# Altium schematic sheet RS485_CCU_HAS.SchDoc: CCU- RS485
size B; DrawnBy: M. Seago; Organization: Gravitas; Address1: Sponsored By:; Address2: Alan Morgan; Address3: Technical Advisor:; Address4: Dr. Joseph Morgan; Revision: 1A; SheetNumber: 6; SheetTotal: 9
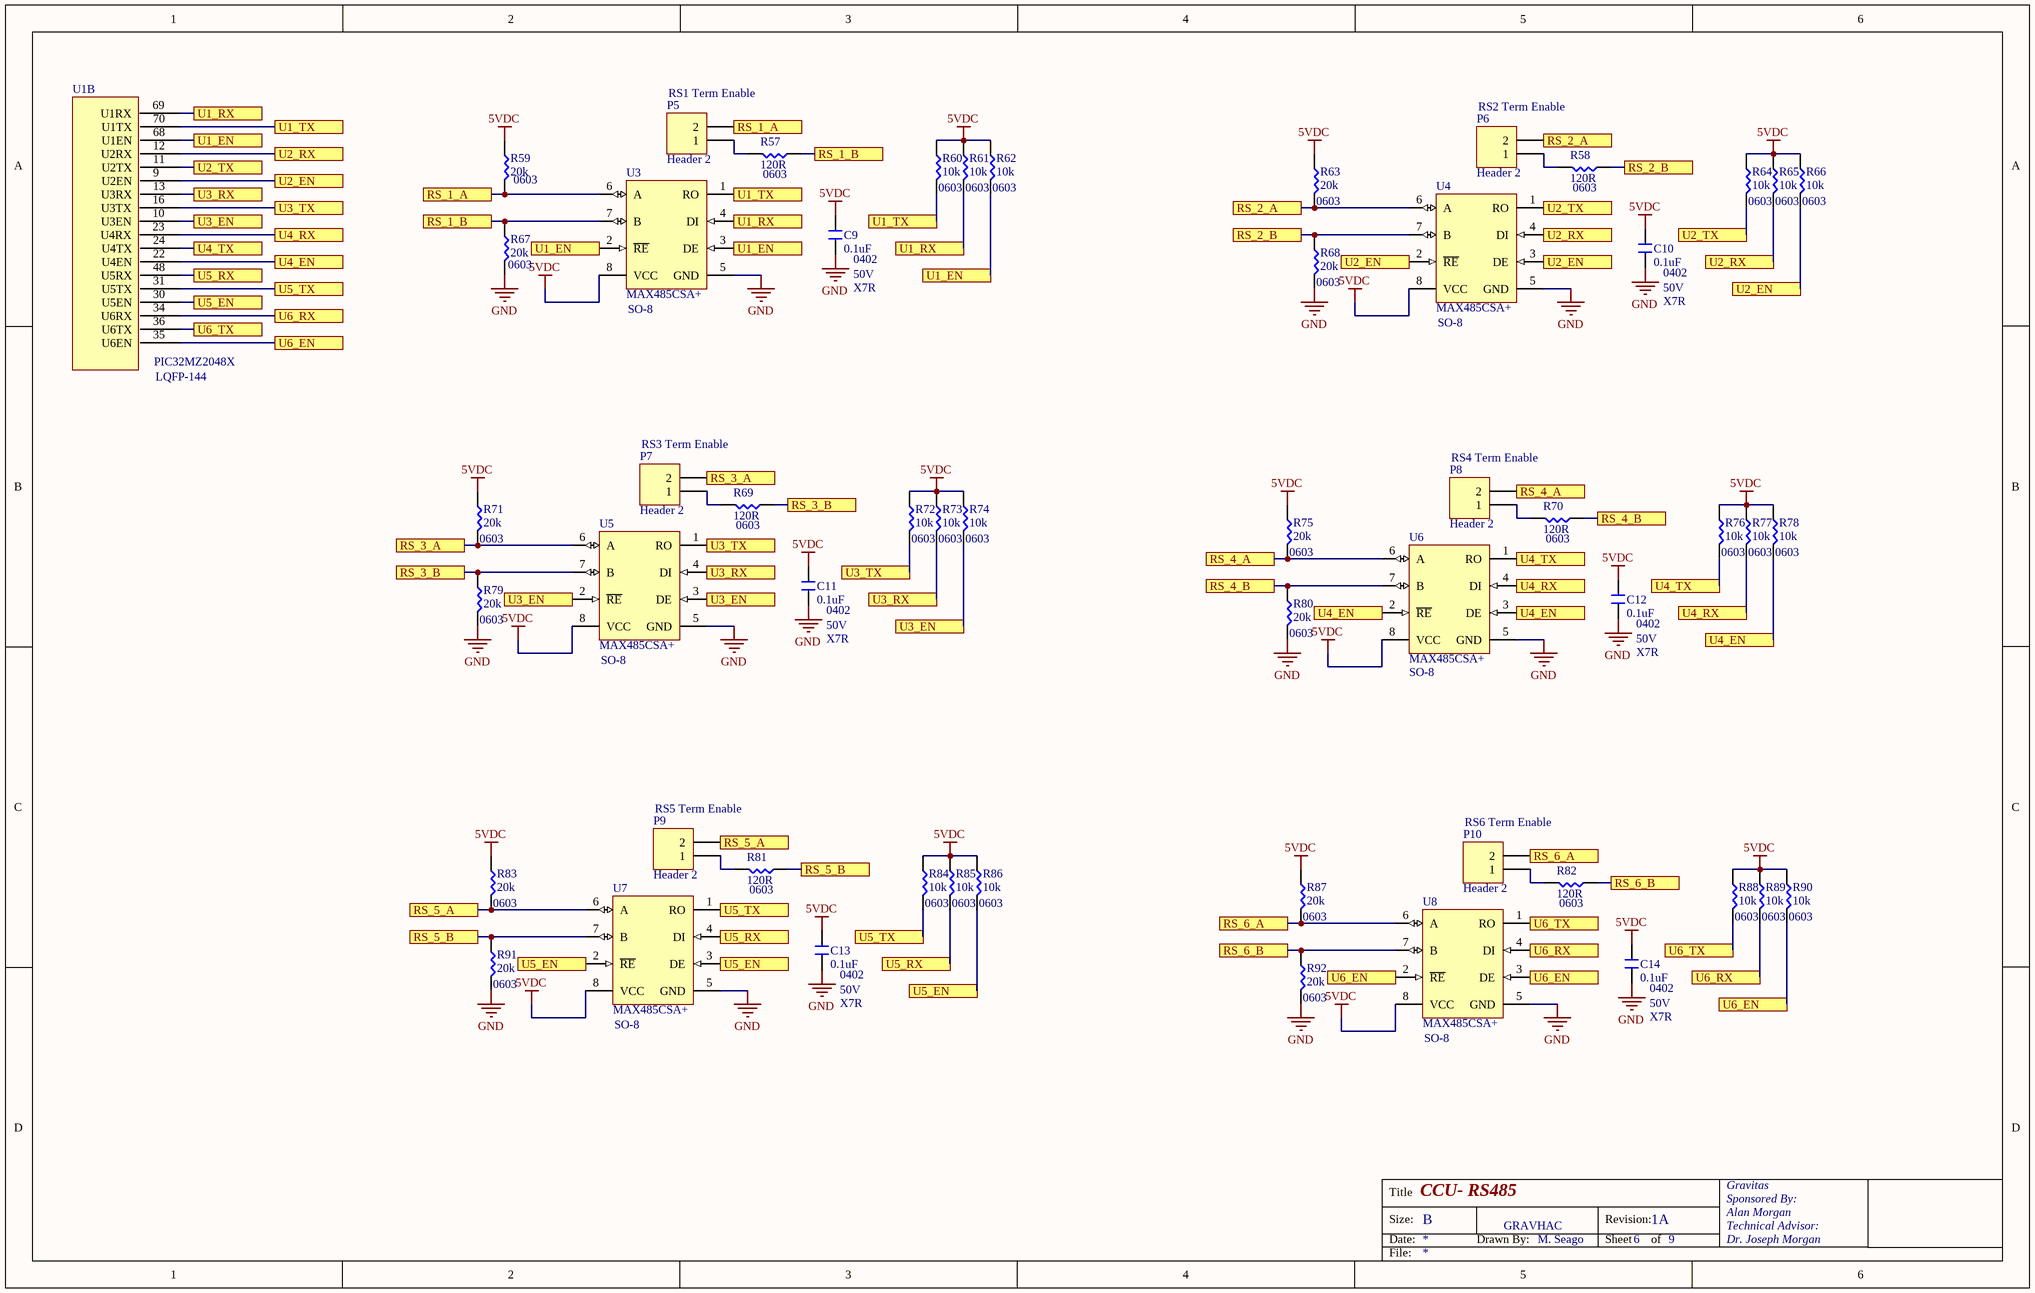
[diagram p0: RS485_CCU_HAS.SchDoc]

## Parts
C9  0.1uF  [NonPolar-0402]
C10  0.1uF  [NonPolar-0402]
C11  0.1uF  [NonPolar-0402]
C12  0.1uF  [NonPolar-0402]
C13  0.1uF  [NonPolar-0402]
C14  0.1uF  [NonPolar-0402]
P5  Header 2  [HDR1X2]
P6  Header 2  [HDR1X2]
P7  Header 2  [HDR1X2]
P8  Header 2  [HDR1X2]
P9  Header 2  [HDR1X2]
P10  Header 2  [HDR1X2]
R57  120R  [NonPolar-0603]
R58  120R  [NonPolar-0603]
R59  20k  [NonPolar-0603]
R60  10k  [NonPolar-0603]
R61  10k  [NonPolar-0603]
R62  10k  [NonPolar-0603]
R63  20k  [NonPolar-0603]
R64  10k  [NonPolar-0603]
R65  10k  [NonPolar-0603]
R66  10k  [NonPolar-0603]
R67  20k  [NonPolar-0603]
R68  20k  [NonPolar-0603]
R69  120R  [NonPolar-0603]
R70  120R  [NonPolar-0603]
R71  20k  [NonPolar-0603]
R72  10k  [NonPolar-0603]
R73  10k  [NonPolar-0603]
R74  10k  [NonPolar-0603]
R75  20k  [NonPolar-0603]
R76  10k  [NonPolar-0603]
R77  10k  [NonPolar-0603]
R78  10k  [NonPolar-0603]
R79  20k  [NonPolar-0603]
R80  20k  [NonPolar-0603]
R81  120R  [NonPolar-0603]
R82  120R  [NonPolar-0603]
R83  20k  [NonPolar-0603]
R84  10k  [NonPolar-0603]
R85  10k  [NonPolar-0603]
R86  10k  [NonPolar-0603]
R87  20k  [NonPolar-0603]
R88  10k  [NonPolar-0603]
R89  10k  [NonPolar-0603]
R90  10k  [NonPolar-0603]
R91  20k  [NonPolar-0603]
R92  20k  [NonPolar-0603]
U1  PIC32MZ2048X  [BIG_PIC32MZ]  (part B of 7)
U3  MAX485CSA+  [MAXM-MAX485CSA+-8_M]
U4  MAX485CSA+  [MAXM-MAX485CSA+-8_M]
U5  MAX485CSA+  [MAXM-MAX485CSA+-8_M]
U6  MAX485CSA+  [MAXM-MAX485CSA+-8_M]
U7  MAX485CSA+  [MAXM-MAX485CSA+-8_M]
U8  MAX485CSA+  [MAXM-MAX485CSA+-8_M]

## Ports
RS_1_A, RS_1_B, RS_2_A, RS_2_B, RS_3_A, RS_3_B, RS_4_A, RS_4_B, RS_5_A, RS_5_B, RS_6_A, RS_6_B, U1_EN, U1_RX, U1_TX, U2_EN, U2_RX, U2_TX, U3_EN, U3_RX, U3_TX, U4_EN, U4_RX, U4_TX, U5_EN, U5_RX, U5_TX, U6_EN, U6_RX, U6_TX

## Nets
5VDC: C9.2 C10.2 C11.2 C12.2 C13.2 C14.2 R59.2 R60.2 R61.2 R62.2 R63.2 R64.2 R65.2 R66.2 R71.2 R72.2 R73.2 R74.2 R75.2 R76.2 R77.2 R78.2 R83.2 R84.2 R85.2 R86.2 R87.2 R88.2 R89.2 R90.2 U3.8(VCC) U4.8(VCC) U5.8(VCC) U6.8(VCC) U7.8(VCC) U8.8(VCC)
GND: C9.1 C10.1 C11.1 C12.1 C13.1 C14.1 R67.1 R68.1 R79.1 R80.1 R91.1 R92.1 U3.5(GND) U4.5(GND) U5.5(GND) U6.5(GND) U7.5(GND) U8.5(GND)
RS_1_A: P5.2 R59.1 U3.6(A) ; port RS_1_A
RS_1_B: R57.2 R67.2 U3.7(B) ; port RS_1_B
RS_2_A: P6.2 R63.1 U4.6(A) ; port RS_2_A
RS_2_B: R58.2 R68.2 U4.7(B) ; port RS_2_B
RS_3_A: P7.2 R71.1 U5.6(A) ; port RS_3_A
RS_3_B: R69.2 R79.2 U5.7(B) ; port RS_3_B
RS_4_A: P8.2 R75.1 U6.6(A) ; port RS_4_A
RS_4_B: R70.2 R80.2 U6.7(B) ; port RS_4_B
RS_5_A: P9.2 R83.1 U7.6(A) ; port RS_5_A
RS_5_B: R81.2 R91.2 U7.7(B) ; port RS_5_B
RS_6_A: P10.2 R87.1 U8.6(A) ; port RS_6_A
RS_6_B: R82.2 R92.2 U8.7(B) ; port RS_6_B
U1_EN: R62.1 U1.68(U1EN) U3.2(~{RE}) U3.3(DE) ; port U1_EN
U1_RX: R61.1 U1.69(U1RX) U3.4(DI) ; port U1_RX
U1_TX: R60.1 U1.70(U1TX) U3.1(RO) ; port U1_TX
U2_EN: R66.1 U1.9(U2EN) U4.2(~{RE}) U4.3(DE) ; port U2_EN
U2_RX: R65.1 U1.12(U2RX) U4.4(DI) ; port U2_RX
U2_TX: R64.1 U1.11(U2TX) U4.1(RO) ; port U2_TX
U3_EN: R74.1 U1.10(U3EN) U5.2(~{RE}) U5.3(DE) ; port U3_EN
U3_RX: R73.1 U1.13(U3RX) U5.4(DI) ; port U3_RX
U3_TX: R72.1 U1.16(U3TX) U5.1(RO) ; port U3_TX
U4_EN: R78.1 U1.22(U4EN) U6.2(~{RE}) U6.3(DE) ; port U4_EN
U4_RX: R77.1 U1.23(U4RX) U6.4(DI) ; port U4_RX
U4_TX: R76.1 U1.24(U4TX) U6.1(RO) ; port U4_TX
U5_EN: R86.1 U1.30(U5EN) U7.2(~{RE}) U7.3(DE) ; port U5_EN
U5_RX: R85.1 U1.48(U5RX) U7.4(DI) ; port U5_RX
U5_TX: R84.1 U1.31(U5TX) U7.1(RO) ; port U5_TX
U6_EN: R90.1 U1.35(U6EN) U8.2(~{RE}) U8.3(DE) ; port U6_EN
U6_RX: R89.1 U1.34(U6RX) U8.4(DI) ; port U6_RX
U6_TX: R88.1 U1.36(U6TX) U8.1(RO) ; port U6_TX
NetP5_1: P5.1 R57.1
NetP6_1: P6.1 R58.1
NetP7_1: P7.1 R69.1
NetP8_1: P8.1 R70.1
NetP9_1: P9.1 R81.1
NetP10_1: P10.1 R82.1

## Notes on the sheet
- (near P5) RS1 Term Enable
- (near P6) RS2 Term Enable
- (near R59) 0603
- (near R57) 0603
- 0603
- (near R62) 0603
- (near R63) 0603
- (near R58) 0603
- (near R66) 0603
- (near R67) 0603
- (near C9) 0402
- (near C9) 50V
- (near C9) X7R
- (near R68) 0603
- (near C10) 0402
- (near C10) 50V
- (near U3) SO-8
- (near U4) SO-8
- (near C10) X7R
- (near U1) LQFP-144
- (near P7) RS3 Term Enable
- (near P8) RS4 Term Enable
- (near R71) 0603
- (near R69) 0603
- (near R74) 0603
- (near R75) 0603
- (near R70) 0603
- (near R78) 0603
- (near R79) 0603
- (near C11) 0402
- (near C11) 50V
- (near C11) X7R
- (near R80) 0603
- (near C12) 0402
- (near C12) 50V
- (near U5) SO-8
- (near U6) SO-8
- (near C12) X7R
- (near P9) RS5 Term Enable
- (near P10) RS6 Term Enable
- (near R83) 0603
- (near R81) 0603
- (near R86) 0603
- (near R82) 0603
- (near C13) 0402
- (near R87) 0603
- (near R90) 0603
- (near R91) 0603
- (near U7) SO-8
- (near C13) 50V
- (near C13) X7R
- (near R92) 0603
- (near U8) SO-8
- (near C14) 0402
- (near C14) 50V
- (near C14) X7R
- GRAVHAC
- Title
- Size:
- Date:
- B
- Drawn By:
- Revision:
- Sheet
- of
- File:

## Library data of the parts
C9-C14 = Cap - 0402
P5-P10 = Header 2: Header, 2-Pin; LatestRevisionDate: 17-Jul-2002; LatestRevisionNote: Re-released for DXP Platform.; Publisher: Altium Limited
R57-R92 = Res - 0603
U3-U8 = CMP-2000-05211-1: Low-Power, Slew-Rate-Limited RS-485/RS-422 Transceiver, 4.75 to 5.25 V, 0 to 70 degC, 8-Pin SOIC, RoHS, Tape and Reel; Manufacturer: Maxim; No. of Receivers: 1; Transceiver Type: Differential; Supply Voltage Min: 4.75V; IC Generic Number: 485; IC Temperature Range: Commercial; No. of Pins: 8; Supply Voltage Range: 4.75Vto5.25V; Interface: RS-422/RS-485; Supply Voltage Max: 5.25V; Data Rate: 2.5Mbps; Line / Bus Driver / Receiver / Transceiver Type: CMOSDifferential; Supply Current: 500µA; Interface Type: RS422,RS485; Device Type: Transceiver; Manufacturer URL: http://www.maximintegrated.com/; Operating Temperature Range: 0degCto+70degC; Package / Case: SOIC; Digital IC Case Style: SOIC; Operating Temperature Max: 70degC; Device Marking: MAX485CSA+; Driver Case Style: SOIC; Datasheet Version: Rev. 8, 10/2003; Operating Temperature Min: 0degC; Datasheet URL: https://datasheet.ciiva.com/29306/170071-da-01-en-ic-max485csa-so8-29306144.pdf; Base Number: 485; No. of Drivers: 1; Logic Function Number: 485